# Altium schematic sheet Inverted_HS_switch_HI_PWR.SchDoc: Data Logger - Inverted HS Hi Power Switch
size A4; DocumentNumber: DL-MB-8; SheetNumber: 8; SheetTotal: 11
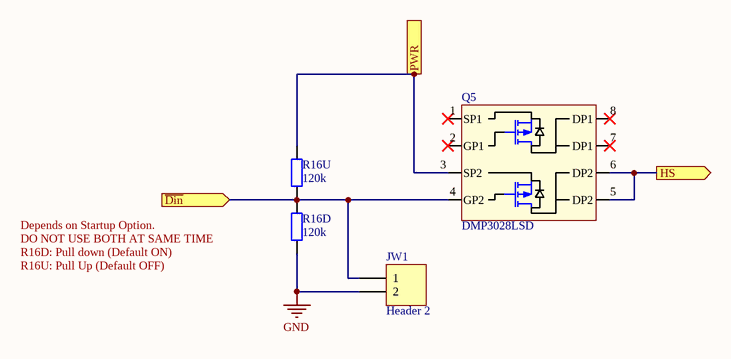
[diagram p0: Inverted_HS_switch_HI_PWR.SchDoc]

## Parts
JW1  Header 2  [HDR1X2]  (no BOM)
Q5  DMP3028LSD  [SOIC-8_SOIC127P600X175-8N]
R16D  120k  [RES-1206_M]
R16U  120k  [RES-1206_M]

## Ports
HS (out), PWR (in), ~{Din} (in)

## Nets
GND: JW1.2 R16D.1
~{Din}: JW1.1 Q5.4(GP2) R16D.2 R16U.1 ; port ~{Din}
HS: Q5.5(DP2) Q5.6(DP2) ; port HS
PWR: Q5.3(SP2) R16U.2 ; port PWR

Not connected (* = marked no-connect by the designer): Q5 1(SP1)* 2(GP1)* 7(DP1)* 8(DP1)*

## Notes on the sheet
- Depends on Startup Option.
  DO NOT USE BOTH AT SAME TIME
  R16D: Pull down (Default ON)
  R16U: Pull Up (Default OFF)
- Title
- Size
- Date:
- A4
- Number
- Time:
- Sheet
- of
- Revision
- File:
- Drawn By:

## Library data of the parts
JW1 = Header 2: Header, 2-Pin, Optional short to GND for PFET; LatestRevisionDate: 17-Jul-2002; LatestRevisionNote: Re-released for DXP Platform.; Publisher: Altium Limited
Q5 = DMP3028LSD: MOSFET 2P-CH 30V 6A SO-8, VgMax=20V, Max Drain Resistance (38 mΩ); Manufacturer: Diodes; Manufacturer Part Number: DMP3028LSD-13; Rds On Max: 25mR; Input Capacitance: 1.241nF; Max Power Dissipation: 1.3W; RoHS: Yes; Category: MOSFETs; Mount: Surface Mount; Case/Package: SOIC; Min Operating Temperature: -55°C; Max Operating Temperature: 150°C; Packaging: Tape and Reel; Drain to Source Voltage (Vdss): 30V; Continuous Drain Current (ID): 6A; RoHS Compliant: Yes; ComponentLink1URL: http://www.mouser.com/ds/2/115/DMP3028LSD-776487.pdf?src-supplier=Mouser; ComponentLink1Description: http://www.mouser.com/ds/2/115/DMP3028LSD-776487.pdf?src-supplier=Mouser; ComponentLink2URL: https://www.diodes.com/assets/Datasheets/DMP3028LSD.pdf?src-supplier=Digi-Key; ComponentLink2Description: https://www.diodes.com/assets/Datasheets/DMP3028LSD.pdf?src-supplier=Digi-Key
R16D R16U = Res2: Resistor; Published: 8-Jun-2000; LatestRevisionDate: 17-Jul-2002; LatestRevisionNote: Re-released for DXP Platform.; PackageReference: 1206; Publisher: Altium Limited; PackageDescription: Chip Resistor 1206 Case Size; Value: 120k